# Altium schematic sheet 77_TP_interface.SchDoc: P30L
size A4; Organization: 六零加智能科技; Address4: www.nidone.com.cn; DocumentNumber: Kang jin; Revision: 1.0; SheetNumber: 21; SheetTotal: 23
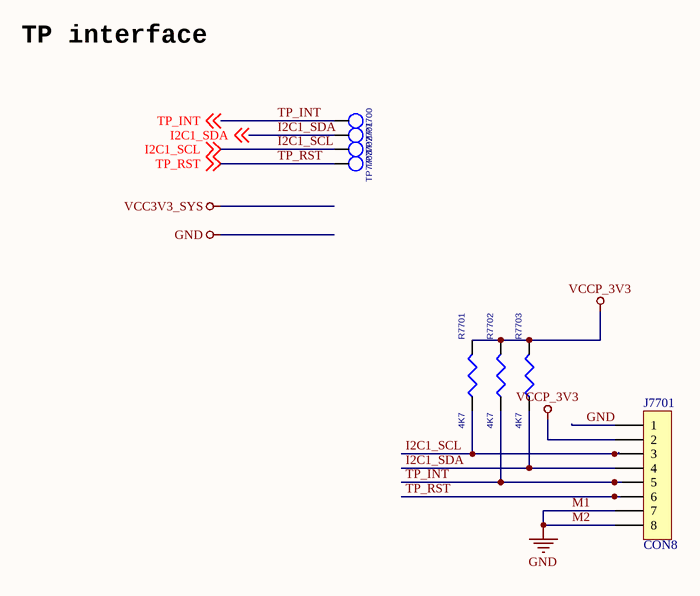
[diagram p0: 77_TP_interface.SchDoc]

## Parts
J7701  CON8  [X05A10H06G]
R7701  4K7  [R0402]
R7702  4K7  [R0402]
R7703  4K7  [R0402]
TP7700  TP_0.7  [TEST]  (value not drawn)
TP7701  TP_0.7  [TEST]  (value not drawn)
TP7702  TP_0.7  [TEST]  (value not drawn)
TP7703  TP_0.7  [TEST]  (value not drawn)

## Nets
GND: J7701.1 J7701.7 J7701.8  [also labelled M1, M2]
VCCP_3V3: J7701.2 R7701.2 R7702.2 R7703.2
I2C1_SCL: J7701.3 R7701.1 TP7702.1 ; off-sheet I2C1_SCL
I2C1_SDA: J7701.4 R7703.1 TP7701.1 ; off-sheet I2C1_SDA
TP_INT: J7701.5 R7702.1 TP7700.1 ; off-sheet TP_INT
TP_RST: J7701.6 TP7703.1 ; off-sheet TP_RST

## Notes on the sheet
- TP interface
- Title
- Size:
- Date:
- A4
- Engineer:
- Time:
- Revision:
- Sheet
- of
- File:

## Library data of the parts
J7701 = CON8: Connector; pin to pad: 7>none 8>none
R7701-R7703 = RES 1B: ROHS CHIP RES 1.65KOhm 1/16W +/-1%
TP7700-TP7703 = TP: Test Point 0.7mm; RK PN: TESTPOINT_0R7; Priority: A; Part Type: TP; Created by: JJJ